# EAGLE design dip_version_square_mess_0_1 (EAGLE 5.06)
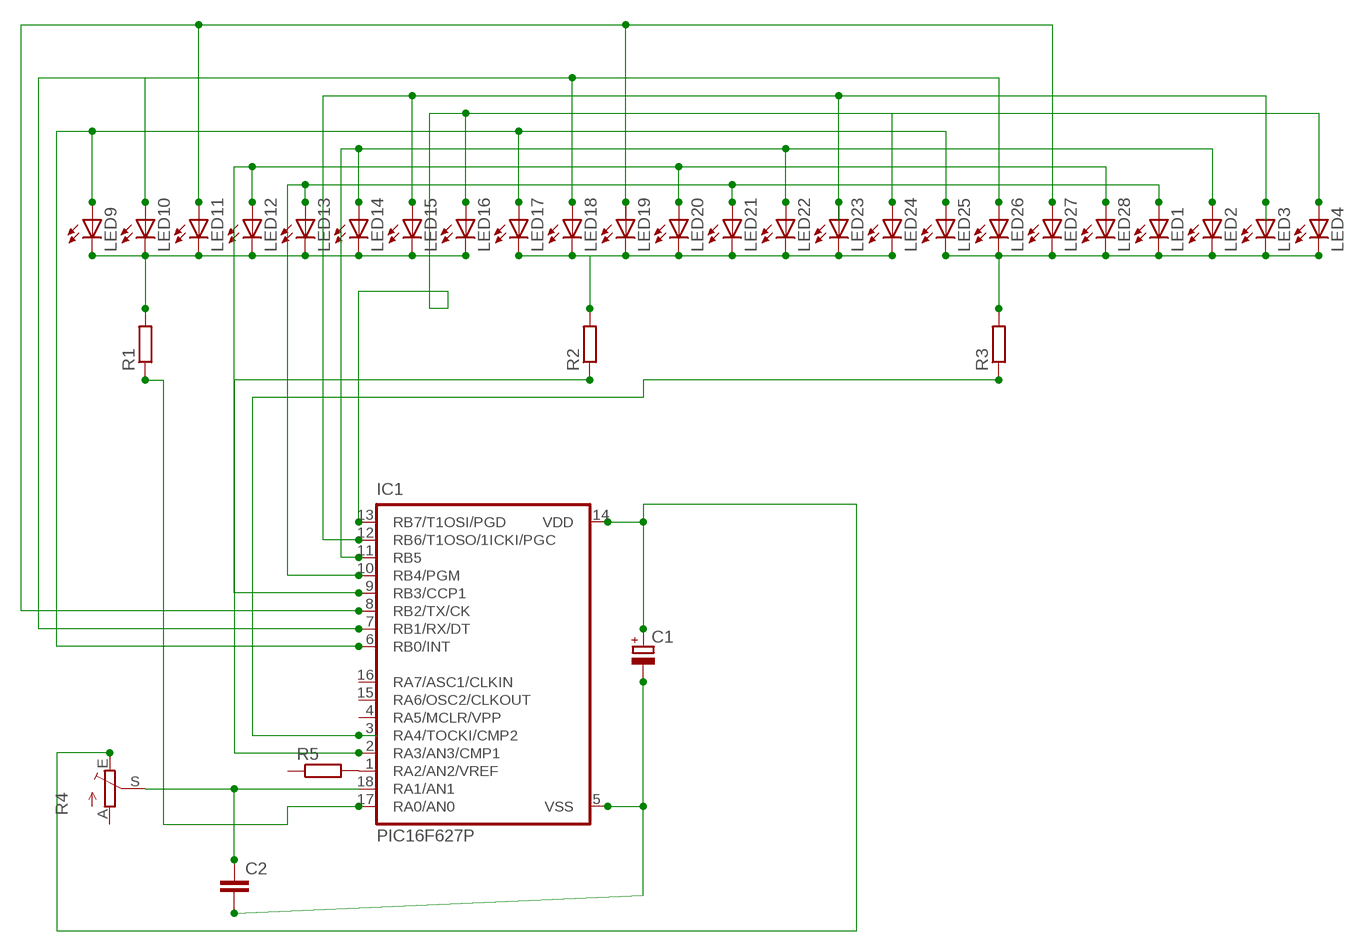
[diagram p0: schematic, sheet 1]

## Parts
C1  CPOL-EUTT6D6  [TT5D6]
C2  C-EU050-030X075  [C050-030X075]
IC1  PIC16F627P  [DIL18]
LED1  LED5MM  [LED5MM]
LED2  LED5MM  [LED5MM]
LED3  LED5MM  [LED5MM]
LED4  LED5MM  [LED5MM]
LED9  LED5MM  [LED5MM]
LED10  LED5MM  [LED5MM]
LED11  LED5MM  [LED5MM]
LED12  LED5MM  [LED5MM]
LED13  LED5MM  [LED5MM]
LED14  LED5MM  [LED5MM]
LED15  LED5MM  [LED5MM]
LED16  LED5MM  [LED5MM]
LED17  LED5MM  [LED5MM]
LED18  LED5MM  [LED5MM]
LED19  LED5MM  [LED5MM]
LED20  LED5MM  [LED5MM]
LED21  LED5MM  [LED5MM]
LED22  LED5MM  [LED5MM]
LED23  LED5MM  [LED5MM]
LED24  LED5MM  [LED5MM]
LED25  LED5MM  [LED5MM]
LED26  LED5MM  [LED5MM]
LED27  LED5MM  [LED5MM]
LED28  LED5MM  [LED5MM]
R1  R-EU_0204/7  [0204/7]
R2  R-EU_0204/7  [0204/7]
R3  R-EU_0204/7  [0204/7]
R4  TRIM_EU-LI15  [LI15]
R5  R-EU_0207/15  [0207/15]

## Nets
N$1: LED9.K(C) LED10.K(C) LED11.K(C) LED12.K(C) LED13.K(C) LED14.K(C) LED15.K(C) LED16.K(C) R1.2
N$2: IC1.6(RB0/INT) LED9.A LED17.A LED25.A
N$3: LED17.K(C) LED18.K(C) LED19.K(C) LED20.K(C) LED21.K(C) LED22.K(C) LED23.K(C) LED24.K(C) R2.2
N$4: LED1.K(C) LED2.K(C) LED3.K(C) LED4.K(C) LED25.K(C) LED26.K(C) LED27.K(C) LED28.K(C) R3.2
N$5: IC1.7(RB1/RX/DT) LED10.A LED18.A LED26.A
N$6: IC1.8(RB2/TX/CK) LED11.A LED19.A LED27.A
N$7: IC1.9(RB3/CCP1) LED12.A LED20.A LED28.A
N$8: IC1.10(RB4/PGM) LED1.A LED13.A LED21.A
N$9: IC1.11(RB5) LED2.A LED14.A LED22.A
N$10: IC1.12(RB6/T1OSO/1ICKI/PGC) LED3.A LED15.A LED23.A
N$11: IC1.13(RB7/T1OSI/PGD) LED4.A LED16.A LED24.A
N$12: IC1.17(RA0/AN0) R1.1
N$13: IC1.2(RA3/AN3/CMP1) R2.1
N$14: IC1.3(RA4/TOCKI/CMP2) R3.1
N$15: C1.- C2.2 IC1.5(VSS)
N$16: C1.+ IC1.14(VDD) R4.E
N$17: C2.1 IC1.18(RA1/AN1) R4.S
N$18: IC1.1(RA2/AN2/VREF) R5.2
Unconnected: IC1.4(RA5/MCLR/VPP) IC1.15(RA6/OSC2/CLKOUT) IC1.16(RA7/ASC1/CLKIN) R4.A R5.1

## Library data of the parts
C1 = rcl:CPOL-EU: POLARIZED CAPACITOR, European symbol
C2 = rcl:C-EU: CAPACITOR, European symbol
IC1 = microchip:PIC16*F62: FLASH-Based 8-Bit CMOS Microcontroller Source: http://ww1.microchip.com/downloads/en/DeviceDoc/40300C.pdf
LED1-LED4 LED9-LED28 = led:LED: LED OSRAM: - CHIPLED LG R971, LG N971, LY N971, LG Q971, LY Q971, LO R971, LY R971 LH N974, LH R974 LS Q976, LO Q976, LY Q976 LO Q996 - Hyper CHIPLED LW Q18S LB Q993, LB Q99A, LB R99A - SideLED LS A670, LO A670, LY A670, LG A670, LP A670 LB A673, LV A673, LT A673, LW A673 LH A674 LY A675 LS A676, LA A676, LO A676, LY A676, LW A676 LS A679, LY A679, LG A679 - Hyper Micro SIDELED® LS Y876, LA Y876, LO Y876, LY Y876 LT Y87S - SmartLED LW L88C, LW L88S LB L89C, LB L89S, LG L890 LS L89K, LO L89K, LY L89K LS L896, LA L896, LO L896, LY L896 - TOPLED LS T670, LO T670, LY T670, LG T670, LP T670 LSG T670, LSP T670, LSY T670, LOP T670, LYG T670 LG T671, LOG T671, LSG T671 LB T673, LV T673, LT T673, LW T673 LH T674 LS T676, LA T676, LO T676, LY T676, LB T676, LH T676, LSB T676, LW T676 LB T67C, LV T67C, LT T67C, LS T67K, LO T67K, LY T67K, LW E67C LS E67B, LA E67B, LO E67B, LY E67B, LB E67C, LV E67C, LT E67C LW T67C LS T679, LY T679, LG T679 LS T770, LO T770, LY T770, LG T770, LP T770 LB T773, LV T773, LT T773, LW T773 LH T774 LS E675, LA E675, LY E675, LS T675 LS T776, LA T776, LO T776, LY T776, LB T776 LHGB T686 LT T68C, LB T68C - Hyper Mini TOPLED® LB M676 - Mini TOPLED Santana® LG M470 LS M47K, LO M47K, LY M47K Source: http://www.osram.convergy.de LUXEON: - LUMILED® LXK2-PW12-R00, LXK2-PW12-S00, LXK2-PW14-U00, LXK2-PW14-V00 LXK2-PM12-R00, LXK2-PM12-S00, LXK2-PM14-U00 LXK2-PE12-Q00, LXK2-PE12-R00, LXK2-PE12-S00, LXK2-PE14-T00, LXK2-PE14-U00 LXK2-PB12-K00, LXK2-PB12-L00, LXK2-PB12-M00, LXK2-PB14-N00, LXK2-PB14-P00, LXK2-PB14-Q00 LXK2-PR12-L00, LXK2-PR12-M00, LXK2-PR14-Q00, LXK2-PR14-R00 LXK2-PD12-Q00, LXK2-PD12-R00, LXK2-PD12-S00 LXK2-PH12-R00, LXK2-PH12-S00 LXK2-PL12-P00, LXK2-PL12-Q00, LXK2-PL12-R00 Source: www.luxeon.com KINGBRIGHT: KA-3528ASYC Source: www.kingbright.com
R1-R3 R5 = resistor:R-EU_: RESISTOR, European symbol
R4 = pot:TRIM_EU-: POTENTIOMETER

## Board
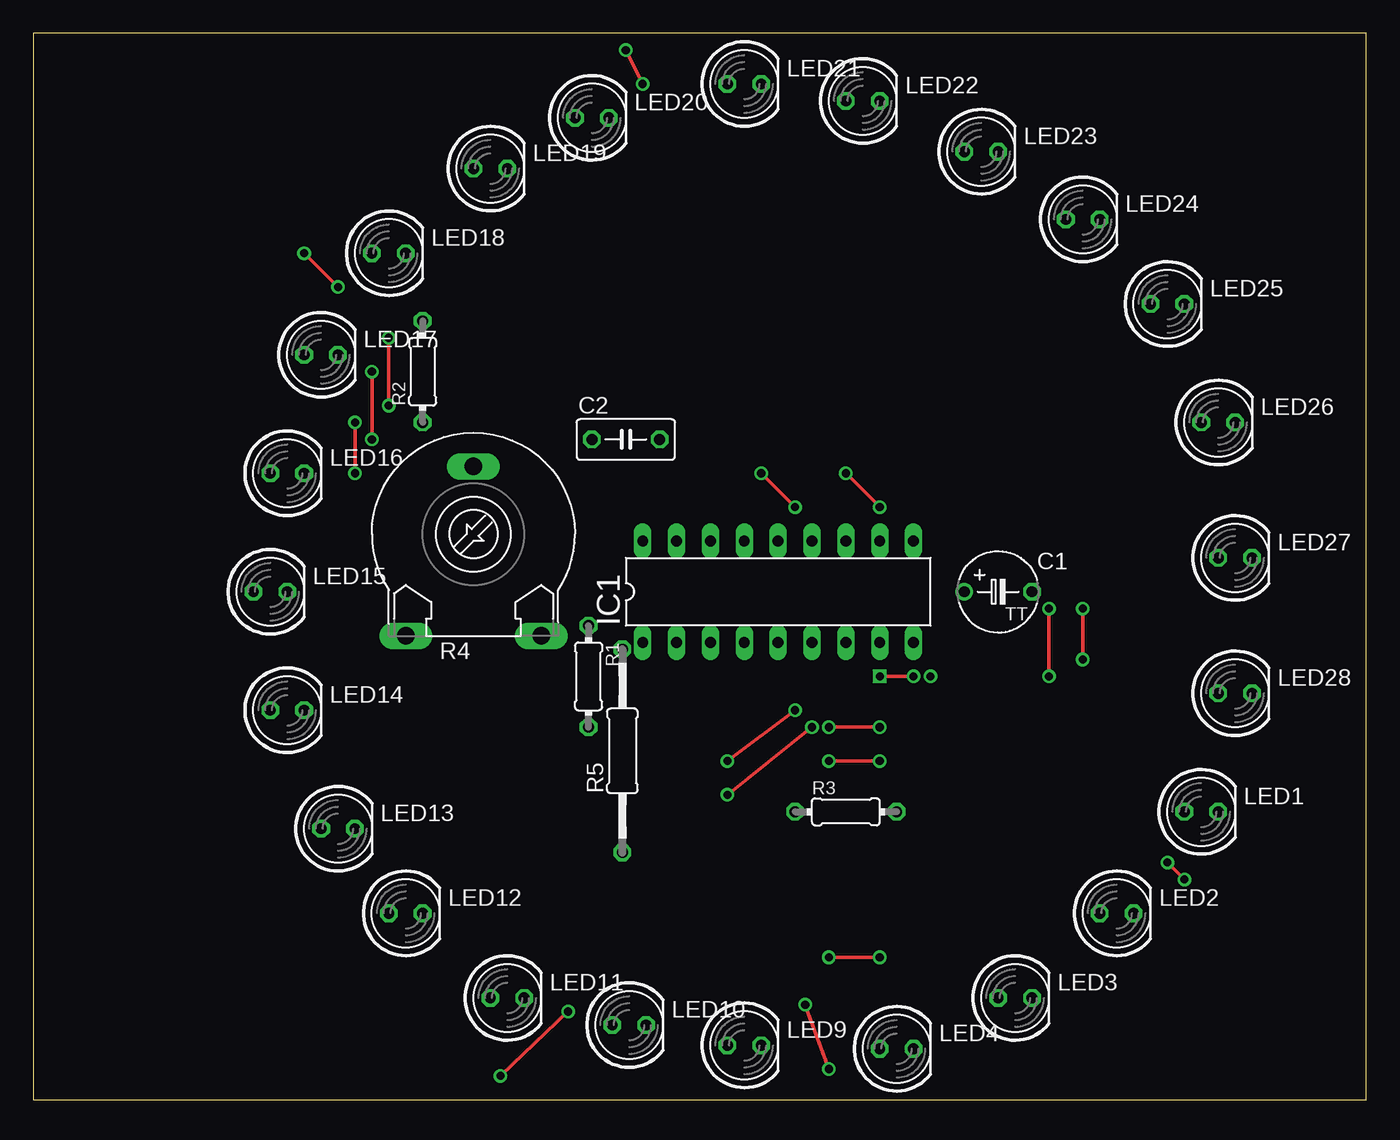
[diagram p1: board, top side]
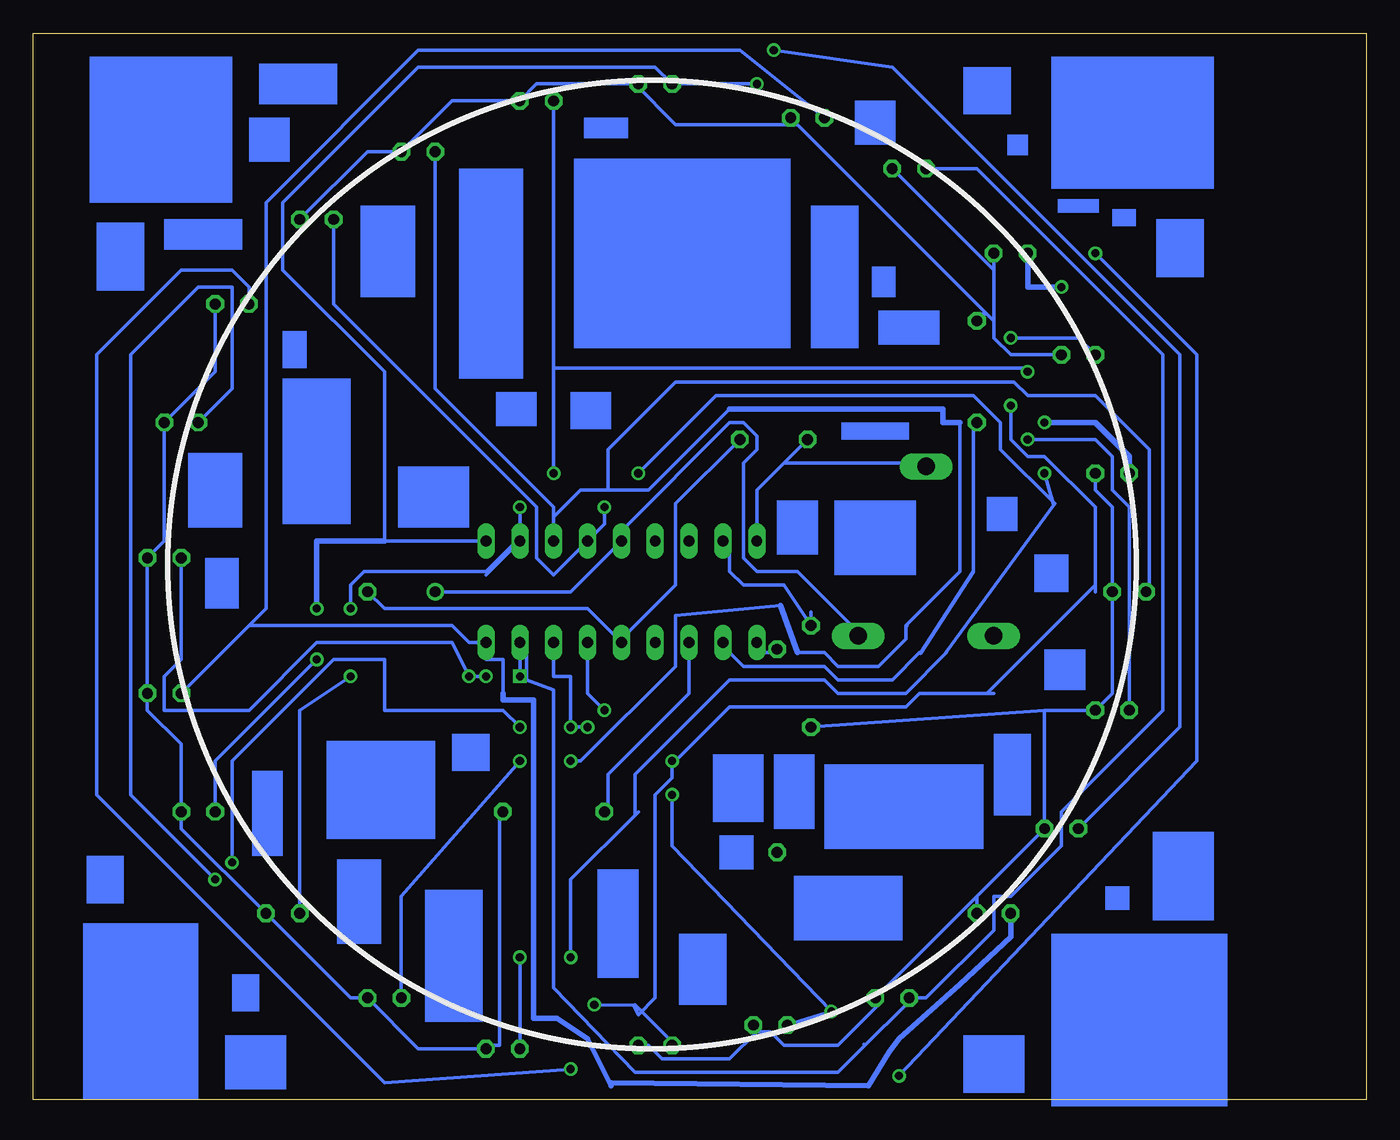
[diagram p2: board, bottom side, seen from below]

Size 100 x 80 mm. Coordinates in mm from the lower left corner, seen from the top.
Outline: 0,0 100,0 100,80 0,80 0,0
Copper layers (1*16): Top 0.035mm / dielectric 1.5mm / Bottom 0.035mm
Design rules "default": minimum track width 10mil, minimum drill 24mil, track to track 8mil, track to pad 8mil, pad to pad 8mil, via to via 8mil, smd to smd 8mil, copper to edge 40mil, drill to drill 8mil, minimum pad ring 10mil, minimum via ring 8mil, stop-mask expansion 4mil, vias tented up to drill 0mil, thermal gap 10mil

### Footprints (pad centres in the part's own frame; a part is rotated, then mirrored left to right if it is on the bottom)
TT5D6 = drill 0.813 round: + -2.54,0 | drill 0.813 octagon: - 2.54,0
C050-030X075 = drill 0.813 octagon: 1 -2.54,0; 2 2.54,0
DIL18 = drill 0.813 long: 1 -10.16,-3.81; 2 -7.62,-3.81; 3 -5.08,-3.81; 4 -2.54,-3.81; 5 0,-3.81; 6 2.54,-3.81; 7 5.08,-3.81; 8 7.62,-3.81; 9 10.16,-3.81; 10 10.16,3.81; 11 7.62,3.81; 12 5.08,3.81; 13 2.54,3.81; 14 0,3.81; 15 -2.54,3.81; 16 -5.08,3.81; 17 -7.62,3.81; 18 -10.16,3.81
LED5MM = drill 0.813 octagon: A -1.27,0; K 1.27,0
0204/7 = drill 0.813 octagon: 1 -3.81,0; 2 3.81,0
LI15 = drill 1.321 long: A -5.08,-7.62; E 5.08,-7.62; S 0,5.08
0207/15 = drill 0.813 octagon: 1 -7.62,0; 2 7.62,0

### Placement (x,y rotation side)
C1  72.39,38.1 0 top
C2  44.45,49.53 0 top
IC1  55.88,38.1 0 top
LED1  87.63,21.59 0 top
LED2  81.28,13.97 0 top
LED3  73.66,7.62 0 top
LED4  64.77,3.81 0 top
LED9  53.34,4.06 0 top
LED10  44.7,5.59 0 top
LED11  35.56,7.62 0 top
LED12  27.94,13.97 0 top
LED13  22.86,20.32 0 top
LED14  19.05,29.21 0 top
LED15  17.78,38.1 0 top
LED16  19.05,46.99 0 top
LED17  21.59,55.88 0 top
LED18  26.67,63.5 0 top
LED19  34.29,69.85 0 top
LED20  41.91,73.66 0 top
LED21  53.34,76.2 0 top
LED22  62.23,74.93 0 top
LED23  71.12,71.12 0 top
LED24  78.74,66.04 0 top
LED25  85.09,59.69 0 top
LED26  88.9,50.8 0 top
LED27  90.17,40.64 0 top
LED28  90.17,30.48 0 top
R1  41.66,31.75 270 top
R2  29.21,54.61 90 top
R3  60.96,21.59 0 top
R4  33.02,42.42 0 top
R5  44.2,26.16 90 top

### Tracks (layer width: path | path; a pad name or v marks a point on that pad's centre or on a via)
N$1
  Bottom 0.254: LED12.K 29.21,15.24 | 29.21,15.24 LED13.K 24.13,29.21 | 29.21,15.24 LED11.K 36.58,7.11 39.62,4.06 43.69,4.06 44.7,5.08 45.72,5.08 | 24.13,29.21 LED14.K 19.05,30.48 LED15.K 19.05,44.45 20.32,45.72 LED16.K | 24.13,29.21 R1.2 | 45.72,5.08 47.75,3.05 52.83,3.05 53.85,4.06 LED9.K 54.86,4.06 | 45.72,5.08 LED10.K
N$2  (via drill 0.61)
  Top 0.254: v26.67,52.07 v26.67,57.15 | v52.07,25.4 v57.15,29.21 | v57.91,7.11 v59.69,2.29
  Bottom 0.254: v26.67,57.15 21.59,57.15 LED17.A | v26.67,52.07 26.67,49.53 25.4,48.26 24.13,48.26 20.32,44.45 20.32,38.61 | IC1.6 58.42,30.48 v57.15,29.21 | v59.69,2.29 73.66,1.27 95.25,22.86 95.25,55.88 88.9,62.23 85.09,62.23 83.82,60.96 LED25.A | 20.32,38.61 20.32,38.1 | 54.97,7.06 54.61,6.35 53.34,7.62 53.34,22.86 52.07,24.13 v52.07,25.4 51.82,25.4 47.75,29.46 34.54,29.46 33.53,30.48 28.45,30.48 | 54.97,7.06 v57.91,7.11 | 28.45,30.48 27.94,30.48 | 28.45,30.48 20.32,38.61 | LED9.A 51.82,4.06 54.86,7.11 54.97,7.06
N$3
  Bottom 0.254: LED24.K 74.93,71.12 LED23.K 68.58,74.93 LED22.K 62.23,76.2 54.86,76.2 | LED17.K 26.67,55.88 27.94,57.15 27.94,58.42 | 27.94,62.23 LED18.K | 27.94,58.42 27.94,62.23 | 27.94,62.23 LED19.K | 27.94,58.42 28.45,58.93 | 28.45,58.93 42.67,73.15 | 42.67,73.15 LED20.K | 28.45,58.93 29.46,58.93 R2.2 | 54.86,76.2 51.82,73.15 42.67,73.15 | 54.86,76.2 LED21.K
N$4
  Bottom 0.254: LED25.K 86.36,54.61 LED26.K 90.17,41.91 LED27.K LED28.K 91.44,29.21 88.9,26.67 LED1.K 88.9,20.32 LED2.K 76.2,7.62 LED3.K 71.12,3.81 LED4.K 66.04,4.06 65.02,4.06 65.02,21.34 R3.2
N$5  (via drill 0.61)
  Top 0.254: v59.69,27.94 v63.5,27.94 | v85.09,17.78 v86.36,16.51 | v52.07,22.86 v58.42,27.94 | v35.05,1.78 v40.13,6.6 | v20.32,63.5 v22.86,60.96
  Bottom 0.254: IC1.7 60.96,31.75 59.69,31.75 v59.69,27.94 v58.42,27.94 | v63.5,27.94 64.77,29.21 73.66,29.21 73.66,33.02 77.47,33.02 85.09,25.4 v85.09,17.78 | v86.36,16.51 92.71,22.86 92.71,55.88 87.63,60.96 85.09,60.96 85.09,53.34 LED26.A | v20.32,63.5 12.7,55.88 12.7,25.4 v35.05,1.78 | LED10.A v40.13,6.6 52.07,19.05 v52.07,22.86
  Bottom 0.406: LED18.A 25.4,60.96 v22.86,60.96
N$6  (via drill 0.6, 0.61)
  Top 0.254: v63.5,31.75 v66.04,31.75
  Bottom 0.254: v63.5,31.75 IC1.8 62.99,33.53 62.99,31.5 60.96,30.73 60.96,8.38 54.86,2.03 39.62,2.03 37.59,4.06 | LED19.A 29.21,69.85 15.24,55.88 15.24,29.21 22.86,21.59 22.86,19.05 26.67,15.24 27.94,15.24 27.94,12.7 33.02,7.62 LED11.A 34.54,7.11 37.59,4.06 | LED27.A 88.9,33.02 90.17,31.75 90.17,29.21 83.82,29.21 78.74,34.29 68.58,34.29 v67.31,31.75 v66.04,31.75 | 37.59,4.06 37.67,4.14
N$7
  Bottom 0.254: 64.77,30.48 64.77,33.02 66.04,33.02 IC1.9 67.31,34.29 68.58,35.56 83.82,35.56 | 83.82,35.56 LED28.A | 83.82,35.56 82.55,36.83 82.55,67.31 71.12,78.74 46.99,78.74 LED20.A
  Bottom 0.406: LED12.A 26.67,12.19 30.48,8.64 35.05,4.57 35.81,3.56 37.34,1.02 56.64,1.27 56.64,1.02 58.42,4.57 60.71,6.1 62.48,6.1 62.48,29.97 64.77,29.97 64.77,30.48
N$8  (via drill 0.61)
  Top 0.254: v44.45,78.74 v45.72,76.2 | v78.74,36.83 v78.74,33.02
  Bottom 0.254: LED13.A 13.97,27.94 13.97,55.88 35.56,77.47 v44.45,78.74 | v45.72,76.2 LED21.A 53.34,77.47 71.12,77.47 81.28,67.31 81.28,62.23 73.66,54.61 73.66,41.91 IC1.10 | LED1.A 86.36,25.4 v78.74,33.02
  Bottom 0.406: 73.66,41.91 78.74,41.91 v78.74,36.83
N$9  (via drill 0.61)
  Top 0.254: v76.2,36.83 v76.2,31.75 | v25.4,49.53 v25.4,54.61 | v60.96,46.99 v63.5,44.45
  Bottom 0.254: LED2.A 80.01,29.21 v76.2,31.75 | IC1.11 66.04,39.37 | v63.5,44.45 IC1.11 | LED14.A 17.78,44.45 19.05,45.72 19.05,48.26 20.32,49.53 v25.4,49.53 | 60.96,54.86 v60.96,46.99 | 60.96,54.86 LED22.A | 60.96,54.86 25.4,54.86 v25.4,54.61 | 76.2,36.58 v76.2,36.83 76.2,38.61 75.18,39.62 66.04,39.62 64.01,41.66 IC1.11
N$10  (via drill 0.61)
  Top 0.254: v59.69,25.4 v63.5,25.4
  Bottom 0.254: 60.96,43.69 IC1.12 | 60.96,43.69 60.96,44.45 69.85,53.34 LED23.A | LED3.A 72.39,15.24 v63.5,25.4 | 47.75,51.82 53.85,45.72 56.9,45.72 | 56.9,45.72 58.93,45.72 60.96,43.69 | 59.94,25.4 v59.69,25.4 58.93,25.4 51.82,32.51 51.82,36.32 43.94,37.08 | 56.9,45.72 56.9,48.77 51.82,53.85 26.42,53.85 25.4,52.83 20.32,52.83 16.26,48.77 16.26,38.61 LED15.A | 42.67,33.53 40.64,33.53 39.62,32.51 36.58,32.51 34.54,34.54 34.54,35.56 | 34.54,35.56 34.45,35.52 | 34.54,35.56 30.48,39.62 30.48,50.8
  Bottom 0.406: 47.75,51.82 31.75,51.82 31.75,50.8 30.48,50.8 | 42.67,33.53 43.94,37.08
N$11  (via drill 0.61)
  Top 0.254: v54.61,46.99 v57.15,44.45 | v24.13,46.99 v24.13,50.8 | v63.5,10.67 v59.69,10.67
  Bottom 0.254: v24.13,46.99 23.47,44.67 23.37,44.7 | v57.15,44.45 57.15,43.18 IC1.13 60.96,39.37 62.23,40.64 62.23,44.45 77.47,59.69 LED24.A | v63.5,10.67 LED4.A | v59.69,10.67 59.69,16.51 54.86,21.34 | 54.86,21.34 54.61,21.59 | 54.86,46.74 v54.61,46.99 48.77,52.83 29.46,52.83 27.43,50.8 27.43,48.77 23.37,44.7 | 54.86,21.34 54.86,24.38 47.75,31.5 40.64,31.5 39.62,30.48 34.54,30.48 31.5,33.53 31.52,33.55 23.37,44.7
  Bottom 0.406: LED16.A 17.78,48.26 20.32,50.8 v24.13,50.8
N$12
  Bottom 0.254: 41.66,36.58 R1.1 43.69,38.61 46.74,38.61 47.75,39.62 47.75,41.66 IC1.17
N$13
  Bottom 0.254: IC1.2 47.75,33.53 46.74,32.51 40.64,32.51 39.62,31.5 35.56,31.5 33.53,33.53 33.42,33.46 29.46,39.62 29.46,50.8 R2.1
N$14
  Bottom 0.254: IC1.3 50.8,30.48 56.9,24.38 56.9,21.34 R3.1
N$15
  Bottom 0.254: C1.- 73.66,36.83 58.42,36.83 IC1.5 55.88,34.54 51.82,38.61 51.82,44.7 C2.2 46.74,49.78
N$16
  Bottom 0.254: C1.+ 59.69,38.1 IC1.14 55.88,42.67 47.75,50.8 46.74,50.8 45.72,49.78 45.72,48.77 46.74,47.75 46.74,40.64 45.72,39.62 42.67,39.62 38.61,35.56 R4.E
N$17
  Bottom 0.254: 43.69,47.75 C2.1 41.66,49.78 | 43.69,47.75 45.72,45.72 IC1.18 | 43.69,47.75 33.53,47.75 R4.S
N$18
  Bottom 0.254: R5.2 44.7,33.53 45.72,33.53 IC1.1
(copper drawn outside any net)
  shapes: Bottom area x53